# EAGLE design orienteringsklokke v2 (EAGLE 6.5.0)

## Sheet 1 of 2
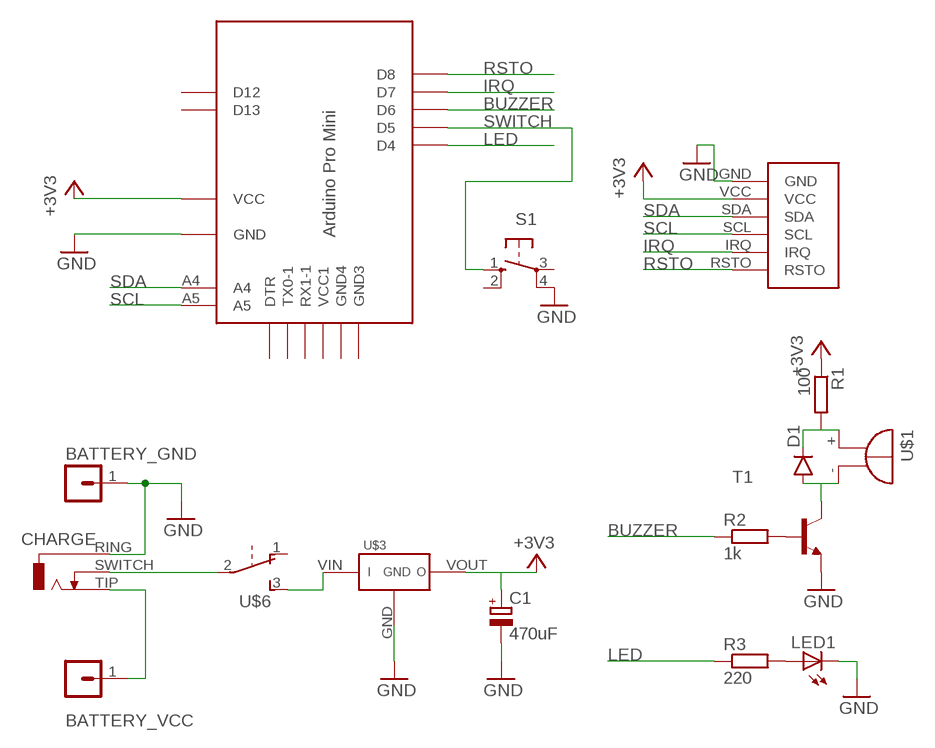
[diagram p0: schematic, sheet 1]

### Parts
BATTERY_GND  MA01-1JC  [MA01-1J]
BATTERY_VCC  MA01-1JC  [MA01-1J]
C1  470uF  CPOL-EUE2.5-6  [E2,5-6]
CHARGE  ST613-JACK  [ST613-JACK]
D1  1N4148DOJ35-5  [DO35-5J]
LED1  LED3MM  [LED3MM]
R1  100  R-EU_0207/7  [0207/7]
R2  1k  R-EU_0207/7  [0207/7]
R3  220  R-EU_0207/7  [0207/7]
S1  10-XX  [B3F-10XX]
T1  2N3904-NPN-TO92-EBC  [TO92-EBC]
U$1  BUZZER_J  [BUZZER_J]
U$2  NFC_MODULE_V3_I2C  [NFC_MODULE_V3_I2C]
U$3  VOLT_BOOST  [VOLT-BOOST]
U$4  ARD-PRO-MINI-ORIENTERING  [ARD_PRO_MINI_ORIENTERING]
U$6  SK12D07-SLIDE-SWITCH  [SK12D07]

### Nets
+3V3: C1.+ R1.1 U$2.VCC U$3.VOUT U$4.VCC
BUZZER: R2.1 U$4.D6
GND: BATTERY_GND.1 C1.- CHARGE.RING LED1.K(C) S1.4(P1) T1.E U$2.GND U$3.GND U$4.GND
IRQ: U$2.IRQ U$4.D7
LED: R3.1 U$4.D4
N$1: CHARGE.SWITCH U$6.2
N$2: D1.A T1.C U$1.-
N$3: R2.2 T1.B
N$4: D1.C R1.2 U$1.+
N$5: LED1.A R3.2
N$6: BATTERY_VCC.1 CHARGE.TIP
N$7: U$3.VIN U$6.3
RSTO: U$2.RSTO U$4.D8
SCL: U$2.SCL U$4.A5
SDA: U$2.SDA U$4.A4
SWITCH: S1.1(S) U$4.D5
Unconnected: S1.2(S1) S1.3(P) U$4.D12 U$4.D13 U$4.DTR U$4.GND2(GND3) U$4.GND3(GND4) U$4.RX1-1 U$4.TX0-1 U$4.VCC1 U$6.1

## Sheet 2 of 2

## Library data of the parts
BATTERY_GND BATTERY_VCC = joakim:MA01-1J: PIN HEADER
C1 = resistor:CPOL-EU: POLARIZED CAPACITOR, European symbol
CHARGE = joakim:ST613-JACK
D1 = joakim:1N4148: DIODE high speed (Philips)
LED1 = led:LED: LED OSRAM: - CHIPLED LG R971, LG N971, LY N971, LG Q971, LY Q971, LO R971, LY R971 LH N974, LH R974 LS Q976, LO Q976, LY Q976 LO Q996 - Hyper CHIPLED LW Q18S LB Q993, LB Q99A, LB R99A - SideLED LS A670, LO A670, LY A670, LG A670, LP A670 LB A673, LV A673, LT A673, LW A673 LH A674 LY A675 LS A676, LA A676, LO A676, LY A676, LW A676 LS A679, LY A679, LG A679 - Hyper Micro SIDELED® LS Y876, LA Y876, LO Y876, LY Y876 LT Y87S - SmartLED LW L88C, LW L88S LB L89C, LB L89S, LG L890 LS L89K, LO L89K, LY L89K LS L896, LA L896, LO L896, LY L896 - TOPLED LS T670, LO T670, LY T670, LG T670, LP T670 LSG T670, LSP T670, LSY T670, LOP T670, LYG T670 LG T671, LOG T671, LSG T671 LB T673, LV T673, LT T673, LW T673 LH T674 LS T676, LA T676, LO T676, LY T676, LB T676, LH T676, LSB T676, LW T676 LB T67C, LV T67C, LT T67C, LS T67K, LO T67K, LY T67K, LW E67C LS E67B, LA E67B, LO E67B, LY E67B, LB E67C, LV E67C, LT E67C LW T67C LS T679, LY T679, LG T679 LS T770, LO T770, LY T770, LG T770, LP T770 LB T773, LV T773, LT T773, LW T773 LH T774 LS E675, LA E675, LY E675, LS T675 LS T776, LA T776, LO T776, LY T776, LB T776 LHGB T686 LT T68C, LB T68C - Hyper Mini TOPLED® LB M676 - Mini TOPLED Santana® LG M470 LS M47K, LO M47K, LY M47K Source: http://www.osram.convergy.de LUXEON: - LUMILED® LXK2-PW12-R00, LXK2-PW12-S00, LXK2-PW14-U00, LXK2-PW14-V00 LXK2-PM12-R00, LXK2-PM12-S00, LXK2-PM14-U00 LXK2-PE12-Q00, LXK2-PE12-R00, LXK2-PE12-S00, LXK2-PE14-T00, LXK2-PE14-U00 LXK2-PB12-K00, LXK2-PB12-L00, LXK2-PB12-M00, LXK2-PB14-N00, LXK2-PB14-P00, LXK2-PB14-Q00 LXK2-PR12-L00, LXK2-PR12-M00, LXK2-PR14-Q00, LXK2-PR14-R00 LXK2-PD12-Q00, LXK2-PD12-R00, LXK2-PD12-S00 LXK2-PH12-R00, LXK2-PH12-S00 LXK2-PL12-P00, LXK2-PL12-Q00, LXK2-PL12-R00 Source: www.luxeon.com KINGBRIGHT: KA-3528ASYC Source: www.kingbright.com
R1-R3 = resistor:R-EU_: RESISTOR, European symbol
S1 = switch-omron:10-XX: OMRON SWITCH; MPN: B3F-1000; OC_FARNELL: 176432; OC_NEWARK: 36M3542
T1 = transistor-neu-to92:*-NPN-: NPN Transistror
U$1 = joakim:BUZZER_J
U$2 = joakim:NFC_MODULE_V3_I2C
U$3 = joakim:VOLT_BOOST
U$4 = joakim:ARD-PRO-MINI-ORIENTERING
U$6 = joakim:SK12D07-SLIDE-SWITCH

## Board
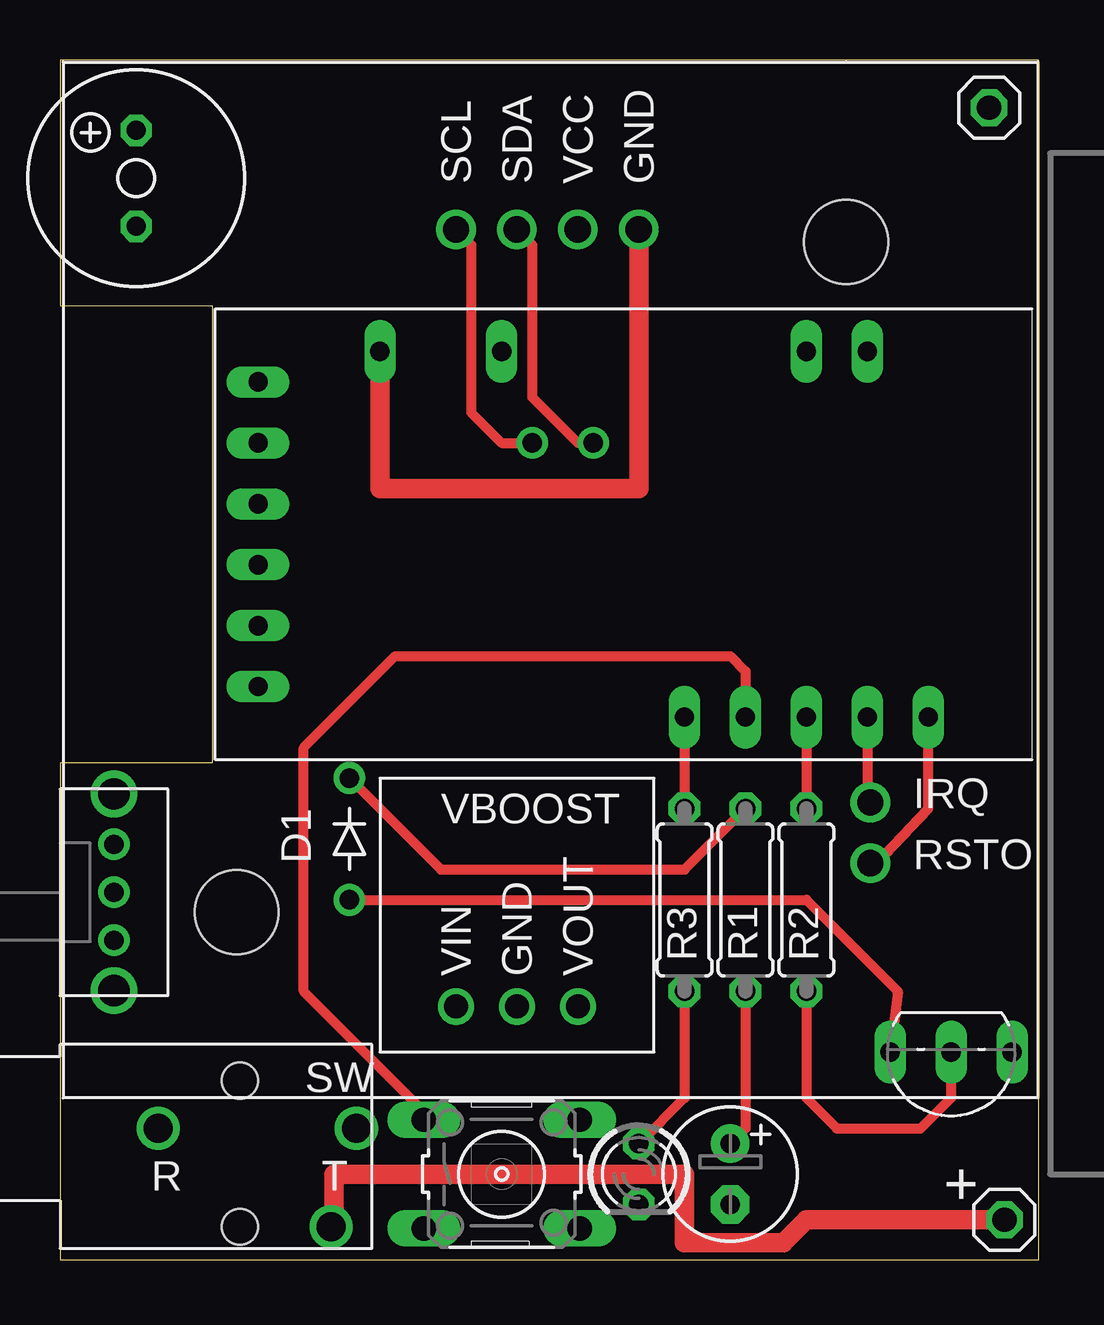
[diagram p1: board, top side]
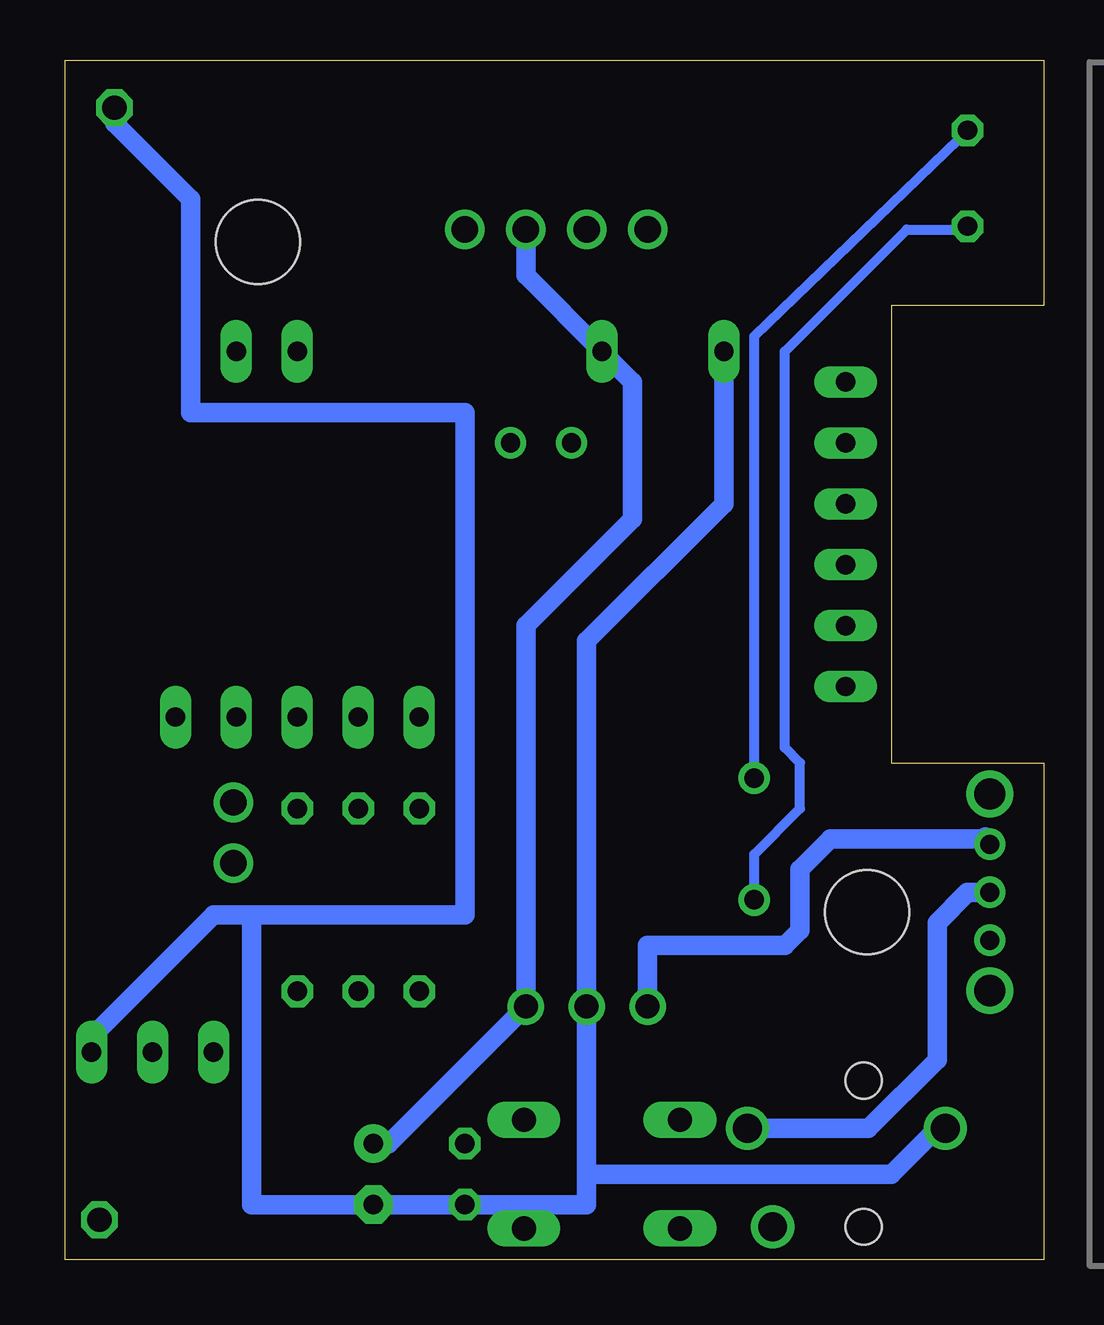
[diagram p2: board, bottom side, seen from below]

Size 40.79 x 50 mm. Coordinates in mm from the lower left corner, seen from the top.
Outline: 0,0 40.79,0 40.79,50 0,50 0,39.76 6.35,39.76 6.35,20.7 0,20.7 0,0
Copper layers (1*16): Top 0.035mm / dielectric 1.5mm / Bottom 0.035mm
Design rules "dirt_cheap_dirty_boards.v1.1-eagle5-7": minimum track width 6mil, minimum drill 12mil, track to track 6mil, track to pad 6mil, pad to pad 6mil, via to via 6mil, smd to smd 0mil, copper to edge 10mil, drill to drill 10mil, minimum pad ring 10mil, minimum via ring 6mil, stop-mask expansion 2mil, vias tented up to drill 25mil, thermal gap 10mil

### Footprints (pad centres in the part's own frame; a part is rotated, then mirrored left to right if it is on the bottom)
MA01-1J = drill 1.016 octagon: 1 0,0
E2,5-6 = drill 0.813 pad 1.6: + -1.27,0 | drill 0.813 pad 1.6 octagon: - 1.27,0
ST613-JACK = drill 1.2: RING 4.1,0; SWITCH 12.35,0; TIP 11.3,-4.1 | hole 1.5: 7.5,2; 7.5,-4.1
DO35-5J = drill 0.813: A 2.54,0; C -2.54,0
LED3MM = drill 0.813 octagon: A -1.27,0; K 1.27,0
0207/7 = drill 0.813 octagon: 1 -3.81,0; 2 3.81,0
B3F-10XX = drill 1.016 long: 1 -3.251,2.261; 2 3.251,2.261; 3 -3.251,-2.261; 4 3.251,-2.261
TO92-EBC = drill 0.813 long: B 0,-1.27; C 2.54,-1.27; E -2.54,-1.27
BUZZER_J = drill 0.8 octagon: + 2,0; - -2,0
NFC_MODULE_V3_I2C = drill 1.1: GND 0,0; IRQ 23.876,9.652; RSTO 26.416,9.652; SCL 0,-7.62; SDA 0,-5.08; VCC 0,-2.54 | hole 3.5: 0.508,8.636; 28.448,-16.764
VOLT-BOOST = drill 1: GND 0,0; VIN -2.54,0; VOUT 2.54,0
ARD_PRO_MINI_ORIENTERING = drill 0.8: A4 3.81,1.27; A5 3.81,3.81 | drill 0.8 long: D4 -7.62,-2.54; D5 -7.62,-5.08; D6 -7.62,-7.62; D7 -7.62,-10.16; D8 -7.62,-12.7; D12 7.62,-10.16; D13 7.62,-7.62; DTR 6.35,15.24; GND 7.62,10.16; GND2 -6.35,15.24; GND3 -3.81,15.24; RX1-1 1.27,15.24; TX0-1 3.81,15.24; VCC 7.62,5.08; VCC1 -1.27,15.24
SK12D07 = drill 0.8: 1 -2,-2.25; 2 0,-2.25; 3 2,-2.25 | drill 1.3 pad 1.7: P$1 -4.1,-2.25; P$2 4.1,-2.25

### Placement (x,y rotation side)
BATTERY_GND  38.73,48.01 0 top
BATTERY_VCC  39.37,1.66 0 top
C1  27.94,3.56 270 top
CHARGE  0,5.46 0 top
D1  12.06,17.53 270 top
LED1  24.13,3.56 270 top
R1  28.57,14.99 90 top
R2  31.11,14.99 270 top
R3  26.04,14.99 270 top
S1  18.41,3.56 0 top
T1  37.15,7.37 180 top
U$1  3.17,45.07 90 top
U$2  24.13,42.93 270 top
U$3  19.05,10.54 0 top
U$4  23.5,30.23 90 top
U$6  0,15.31 90 top

### Tracks (layer width: path | path; a pad name or v marks a point on that pad's centre or on a via)
+3V3
  Top 0.406: R1.1 28.57,5.46 C1.+
  Bottom 0.813: C1.+ 27.3,4.83 U$3.VOUT 21.59,26.42 17.14,30.86 17.14,36.58 U$4.VCC 21.59,41.02 U$2.VCC
BUZZER
  Top 0.406: U$4.D6 R2.1
GND
  Top 0.813: U$2.GND 24.13,32.13 13.34,32.13 U$4.GND
  Bottom 0.813: CHARGE.RING 4.45,5.46 6.35,3.56 19.05,3.56 | U$4.GND 13.34,31.5 19.05,25.79 U$3.GND 19.05,3.56 | BATTERY_GND.1 38.73,47.38 35.56,44.2 35.56,35.31 24.13,35.31 24.13,14.36 33.02,14.36 | 33.02,14.36 33.02,2.29 C1.- LED1.K 21.74,2.29 21.67,2.21 | 33.02,14.36 34.61,14.36 39.69,9.28 T1.E | S1.4 21.67,2.21 | 21.67,2.21 21.59,2.29 19.05,2.29 19.05,3.56
IRQ
  Top 0.406: U$4.D7 33.66,19.18 U$2.IRQ
LED
  Top 0.406: U$4.D4 R3.1
N$1
  Bottom 0.813: CHARGE.SWITCH 7.3,5.46 4.45,8.32 4.45,14.04 3.17,15.31 U$6.2
N$2
  Top 0.406: D1.A 31.11,14.99 34.92,11.18 T1.C
  Bottom 0.406: D1.A 12.06,16.89 10.16,18.8 10.16,20.7 10.79,21.34 10.79,37.85 5.71,42.93 3.31,42.93 U$1.-
N$3
  Top 0.406: R2.2 31.11,6.74 32.38,5.46 35.88,5.46 37.15,6.74 T1.B
N$4
  Top 0.406: D1.C 15.88,16.26 26.04,16.26 R1.2
  Bottom 0.406: D1.C 12.06,38.48 3.5,46.74 U$1.+
N$5
  Top 0.406: R3.2 26.04,6.74 LED1.A
N$6
  Top 0.813: BATTERY_VCC.1 31.11,1.66 30.16,0.7 26.04,0.7 26.04,3.56 11.43,3.56 11.43,1.66 11.01,1.66 CHARGE.TIP
N$7
  Bottom 0.813: U$6.3 2.44,17.62 2.54,17.53 8.89,17.53 10.16,16.26 10.16,13.72 10.79,13.09 16.51,13.09 U$3.VIN
RSTO
  Top 0.406: U$2.RSTO 34.04,16.51 36.2,18.8 U$4.D8
SCL
  Top 0.406: U$2.SCL 17.14,42.3 17.14,35.31 18.41,34.04 U$4.A5
SDA
  Top 0.406: U$2.SDA 19.68,42.3 19.68,35.95 21.59,34.04 U$4.A4
SWITCH
  Top 0.406: S1.1 15.16,6.18 10.16,11.18 10.16,21.34 13.97,25.15 27.94,25.15 28.57,24.52 U$4.D5

### Text on the board
tNames: +